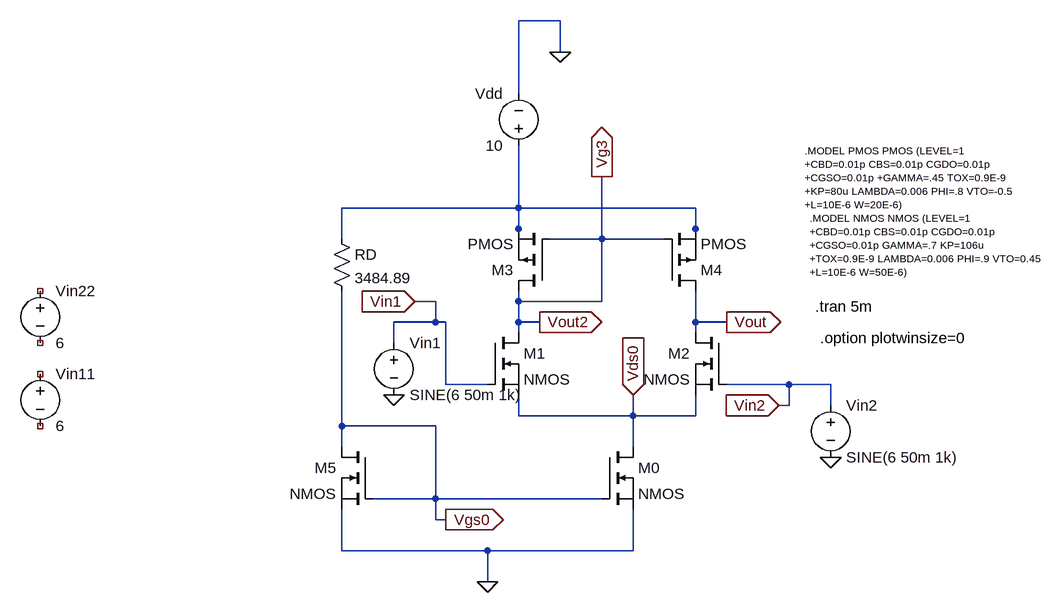
[diagram p0: schematic Second.asc]
Second.asc, the LTspice schematic file:
Version 4
SHEET 1 1316 680
WIRE 528 -240 464 -240
WIRE 528 -192 528 -240
WIRE 464 -128 464 -240
WIRE 464 48 464 -48
WIRE 464 48 192 48
WIRE 736 48 464 48
WIRE 464 80 464 48
WIRE 736 80 736 48
WIRE 192 96 192 48
WIRE 464 96 464 80
WIRE 592 96 592 0
WIRE 592 96 512 96
WIRE 688 96 592 96
WIRE 736 96 736 80
WIRE 336 192 304 192
WIRE 464 192 464 176
WIRE 592 192 592 96
WIRE 592 192 464 192
WIRE 336 224 336 192
WIRE 336 224 272 224
WIRE 352 224 336 224
WIRE 464 224 464 192
WIRE 496 224 464 224
WIRE 736 224 736 176
WIRE 784 224 736 224
WIRE 464 240 464 224
WIRE 736 240 736 224
WIRE 272 256 272 224
WIRE 352 320 352 224
WIRE 416 320 352 320
WIRE 880 320 784 320
WIRE 944 320 880 320
WIRE 880 352 880 320
WIRE 880 352 864 352
WIRE 944 352 944 320
WIRE 464 368 464 336
WIRE 640 368 640 336
WIRE 640 368 464 368
WIRE 736 368 736 336
WIRE 736 368 640 368
WIRE 192 384 192 176
WIRE 336 384 192 384
WIRE 192 416 192 384
WIRE 640 416 640 368
WIRE 336 496 336 384
WIRE 336 496 240 496
WIRE 592 496 336 496
WIRE 336 528 336 496
WIRE 352 528 336 528
WIRE 192 576 192 512
WIRE 416 576 192 576
WIRE 640 576 640 512
WIRE 640 576 416 576
WIRE 416 624 416 576
FLAG 528 -192 0
FLAG 416 624 0
FLAG 944 432 0
FLAG 272 336 0
FLAG 784 224 Vout
IOPIN 784 224 Out
FLAG 496 224 Vout2
IOPIN 496 224 Out
FLAG 864 352 Vin2
IOPIN 864 352 In
FLAG 304 192 Vin1
IOPIN 304 192 In
FLAG 352 528 Vgs0
IOPIN 352 528 Out
FLAG 640 336 Vds0
IOPIN 640 336 In
FLAG 592 0 Vg3
IOPIN 592 0 Out
SYMBOL res 176 80 R0
SYMATTR InstName RD
SYMATTR Value 3484.89
SYMBOL nmos 240 416 M0
SYMATTR InstName M5
SYMBOL nmos 416 240 R0
SYMATTR InstName M1
SYMBOL nmos 784 240 M0
SYMATTR InstName M2
SYMBOL nmos 592 416 R0
SYMATTR InstName M0
SYMBOL voltage 464 -32 R180
WINDOW 0 24 96 Left 2
WINDOW 3 24 16 Left 2
WINDOW 123 0 0 Left 0
WINDOW 39 0 0 Left 0
SYMATTR InstName Vdd
SYMATTR Value 10
SYMBOL voltage 944 336 R0
WINDOW 123 0 0 Left 0
WINDOW 39 0 0 Left 0
SYMATTR InstName Vin2
SYMATTR Value SINE(6 50m 1k)
SYMBOL voltage 272 240 R0
WINDOW 123 0 0 Left 0
WINDOW 39 0 0 Left 0
SYMATTR InstName Vin1
SYMATTR Value SINE(6 50m 1k)
SYMBOL pmos 512 176 R180
SYMATTR InstName M3
SYMBOL pmos 688 176 M180
SYMATTR InstName M4
SYMBOL voltage -272 288 R0
WINDOW 123 0 0 Left 0
WINDOW 39 0 0 Left 0
SYMATTR InstName Vin11
SYMATTR Value 6
SYMBOL voltage -272 160 R0
SYMATTR InstName Vin22
SYMATTR Value 6
TEXT 912 64 Left 1 !.MODEL NMOS NMOS (LEVEL=1\n+CBD=0.01p CBS=0.01p CGDO=0.01p\n+CGSO=0.01p GAMMA=.7 KP=106u\n+TOX=0.9E-9 LAMBDA=0.006 PHI=.9 VTO=0.45\n+L=10E-6 W=50E-6)
TEXT 920 200 Left 2 !.tran 5m
TEXT 928 248 Left 2 !.option plotwinsize=0
TEXT 904 -40 Left 1 !.MODEL PMOS PMOS (LEVEL=1\n+CBD=0.01p CBS=0.01p CGDO=0.01p\n+CGSO=0.01p +GAMMA=.45 TOX=0.9E-9\n+KP=80u LAMBDA=0.006 PHI=.8 VTO=-0.5\n+L=10E-6 W=20E-6)

The netlist it stands for:
* Second.asc
RD N001 Vgs0 3484.89
M5 Vgs0 Vgs0 0 0 NMOS
M1 Vg3 Vin1 Vds0 Vds0 NMOS
M2 Vout Vin2 Vds0 Vds0 NMOS
M0 Vds0 Vgs0 0 0 NMOS
Vdd N001 0 10
Vin2 Vin2 0 SINE(6 50m 1k)
Vin1 Vin1 0 SINE(6 50m 1k)
M3 Vg3 Vg3 N001 N001 PMOS
M4 Vout Vg3 N001 N001 PMOS
Vin11 NC_01 NC_02 6
Vin22 NC_03 NC_04 6
.model NMOS NMOS
.model PMOS PMOS
.lib standard.mos
.MODEL NMOS NMOS (LEVEL=1
+CBD=0.01p CBS=0.01p CGDO=0.01p
+CGSO=0.01p GAMMA=.7 KP=106u
+TOX=0.9E-9 LAMBDA=0.006 PHI=.9 VTO=0.45
+L=10E-6 W=50E-6)
.tran 5m
.option plotwinsize=0
.MODEL PMOS PMOS (LEVEL=1
+CBD=0.01p CBS=0.01p CGDO=0.01p
+CGSO=0.01p +GAMMA=.45 TOX=0.9E-9
+KP=80u LAMBDA=0.006 PHI=.8 VTO=-0.5
+L=10E-6 W=20E-6)
.backanno
.end